# EAGLE design openEMSstim_03 (EAGLE 7.6.0)
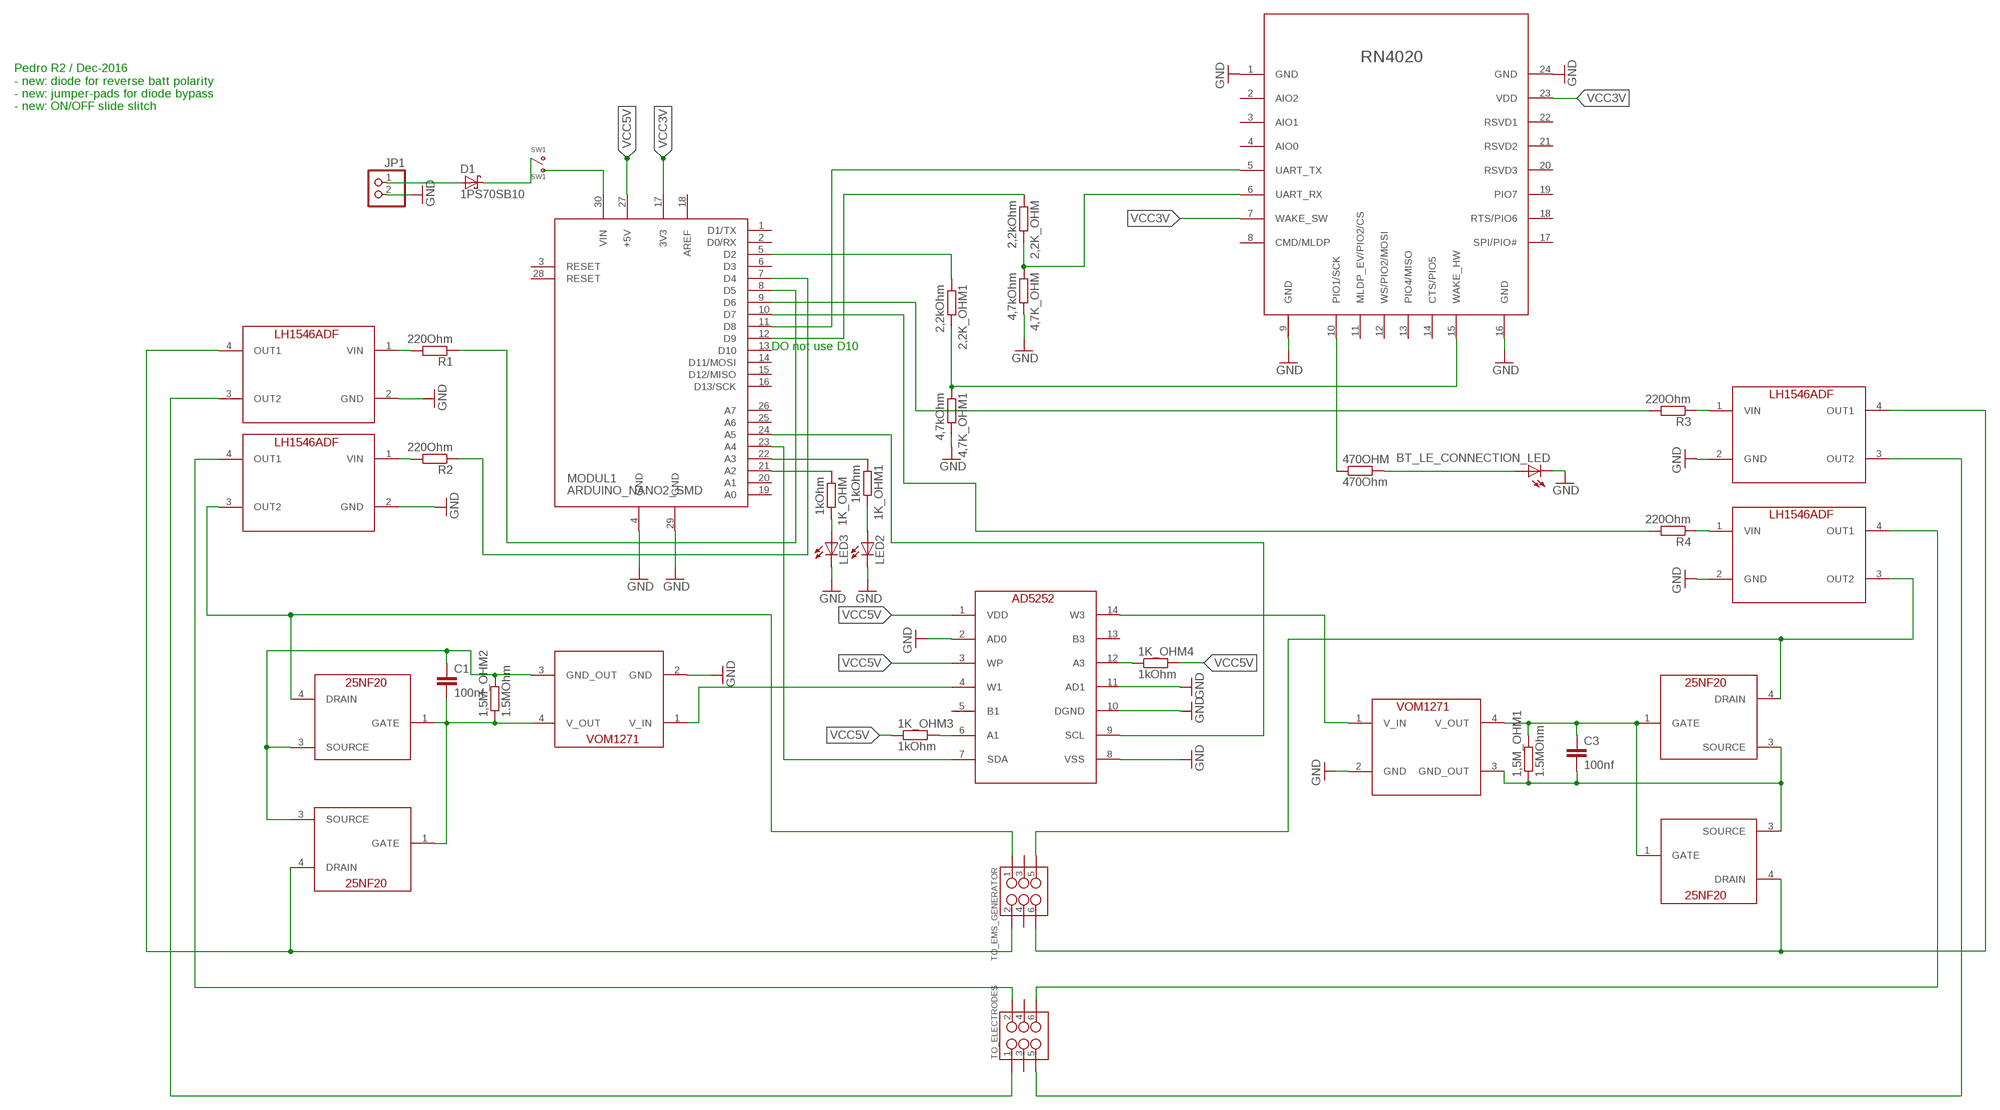
[diagram p0: schematic, sheet 1]

## Parts
1,5M_OHM1  1.5MOhm  R-EU_R0805  [R0805]
1,5M_OHM2  1.5MOhm  R-EU_R0805  [R0805]
1K_OHM  1kOhm  R-EU_R0805  [R0805]
1K_OHM1  1kOhm  R-EU_R0805  [R0805]
1K_OHM3  1kOhm  R-EU_R0805  [R0805]
1K_OHM4  1kOhm  R-EU_R0805  [R0805]
2,2K_OHM  2,2kOhm  R-EU_R0805  [R0805]
2,2K_OHM1  2,2kOhm  R-EU_R0805  [R0805]
4,7K_OHM  4,7kOhm  R-EU_R0805  [R0805]
4,7K_OHM1  4,7kOhm  R-EU_R0805  [R0805]
470OHM  470Ohm  R-EU_R0805  [R0805]
BT_LE_CONNECTION_LED  LEDCHIPLED_0603  [CHIPLED_0603]
C1  100nf  CAP0805  [0805]
C3  100nf  CAP0805  [0805]
D1  1PS70SB10  [SOT323]
JP1  PINHD-1X2  [1X02]
LED2  LEDCHIPLED_0603  [CHIPLED_0603]
LED3  LEDCHIPLED_0603  [CHIPLED_0603]
MODUL1  ARDUINO_NANO2_SMD  [ARDUINO_NANO2_SMD]
MOS01  DEV  [PACK]
MOS02  DEV  [PACK]
MOS03  DEV  [PACK]
MOS04  DEV  [PACK]
R1  220Ohm  R-EU_R0805  [R0805]
R2  220Ohm  R-EU_R0805  [R0805]
R3  220Ohm  R-EU_R0805  [R0805]
R4  220Ohm  R-EU_R0805  [R0805]
SW1  SW1  SSSS810701  [SSSS810701]
TO_ELECTRODES  M03X2  [RIGHT_ANGLED_SHROUED_2X06_6PIN]
TO_EMS_GENERATOR  M03X2  [RIGHT_ANGLED_SHROUED_2X06_6PIN]
U$5  RN4020  [RN4020]
U$6  AD5252  [TSSOP]
U$9  VOM1271  [SOP04]
U$10  VOM1271  [SOP04]
U$11  LH1546ADF  [DIP04-SMD]
U$12  LH1546ADF  [DIP04-SMD]
U$13  LH1546ADF  [DIP04-SMD]
U$14  LH1546ADF  [DIP04-SMD]

## Nets
GND: 4,7K_OHM1.2 4,7K_OHM.2 BT_LE_CONNECTION_LED.C JP1.2 LED2.C LED3.C MODUL1.4(GND) MODUL1.29(GND) U$5.1(GND) U$5.9(GND) U$5.16(GND) U$5.24(GND) U$6.2(AD0) U$6.8(VSS) U$6.10(DGND) U$6.11(AD1) U$9.2(GND) U$10.2(GND) U$11.2(GND) U$12.2(GND) U$13.2(GND) U$14.2(GND)
N$1: U$6.4(W1) U$9.1(V_IN)
N$2: 1K_OHM.1 MODUL1.21(A2)
N$3: MODUL1.23(A4) U$6.7(SDA)
N$4: TO_ELECTRODES.6 U$14.4(OUT1)
N$5: 2,2K_OHM.2 4,7K_OHM.1 U$5.6(UART_RX)
N$6: 2,2K_OHM.1 MODUL1.12(D9)
N$7: TO_ELECTRODES.1 U$11.3(OUT2)
N$8: 1,5M_OHM2.1 C1.2 MOS01.1(GATE) MOS02.1(GATE) U$9.4(V_OUT)
N$9: MODUL1.11(D8) U$5.5(UART_TX)
N$10: MODUL1.24(A5) U$6.9(SCL)
N$11: MODUL1.30(VIN) SW1.1(B)
N$12: R2.2 U$12.1(VIN)
N$13: TO_ELECTRODES.2 U$12.4(OUT1)
N$14: R1.2 U$11.1(VIN)
N$15: R3.1 U$13.1(VIN)
N$16: R4.1 U$14.1(VIN)
N$17: MODUL1.8(D5) R1.1
N$18: MODUL1.7(D4) R2.1
N$19: MODUL1.9(D6) R3.2
N$20: MODUL1.10(D7) R4.2
N$21: MOS01.4(DRAIN) TO_EMS_GENERATOR.1 U$12.3(OUT2)
N$22: U$6.14(W3) U$10.1(V_IN)
N$23: 1,5M_OHM1.2 C3.1 MOS03.1(GATE) MOS04.1(GATE) U$10.4(V_OUT)
N$24: 1,5M_OHM1.1 C3.2 MOS03.3(SOURCE) MOS04.3(SOURCE) U$10.3(GND_OUT)
N$26: 1K_OHM4.1 U$6.12(A3)
N$27: 1,5M_OHM2.2 C1.1 MOS01.3(SOURCE) MOS02.3(SOURCE) U$9.3(GND_OUT)
N$28: MOS03.4(DRAIN) TO_EMS_GENERATOR.5 U$14.3(OUT2)
N$30: MOS02.4(DRAIN) TO_EMS_GENERATOR.2 U$11.4(OUT1)
N$31: TO_ELECTRODES.5 U$13.3(OUT2)
N$32: MOS04.4(DRAIN) TO_EMS_GENERATOR.6 U$13.4(OUT1)
N$33: 2,2K_OHM1.2 4,7K_OHM1.1 U$5.15(WAKE_HW)
N$34: 1K_OHM3.2 U$6.6(A1)
N$35: 2,2K_OHM1.1 MODUL1.5(D2)
N$36: 470OHM.1 U$5.10(PIO1/SCK)
N$37: 470OHM.2 BT_LE_CONNECTION_LED.A
N$39: 1K_OHM1.2 LED2.A
N$40: 1K_OHM1.1 MODUL1.22(A3)
N$42: 1K_OHM.2 LED3.A
N$63: D1.1(A) JP1.1
N$64: D1.3(K) SW1.2(COM)
VCC3V: MODUL1.17(3V3) U$5.7(WAKE_SW) U$5.23(VDD)
VCC5V: 1K_OHM3.1 1K_OHM4.2 MODUL1.27(+5V) U$6.1(VDD) U$6.3(WP)
Unconnected: MODUL1.1(D1/TX) MODUL1.2(D0/RX) MODUL1.3(RESET) MODUL1.6(D3) MODUL1.13(D10) MODUL1.14(D11/MOSI) MODUL1.15(D12/MISO) MODUL1.16(D13/SCK) MODUL1.19(A0) MODUL1.20(A1) MODUL1.25(A6) MODUL1.26(A7) MODUL1.28(RESET) SW1.3(A) TO_ELECTRODES.3 TO_ELECTRODES.4 TO_EMS_GENERATOR.3 TO_EMS_GENERATOR.4 U$5.2(AIO2) U$5.3(AIO1) U$5.4(AIO0) U$5.8(CMD/MLDP) U$5.11(MLDP_EV/PIO2/CS) U$5.12(WS/PIO2/MOSI) U$5.13(PIO4/MISO) U$5.14(CTS/PIO5) U$5.17(SPI/PIO#) U$5.18(RTS/PIO6) U$5.19(PIO7) U$5.20(RSVD3) U$5.21(RSVD2) U$5.22(RSVD1) U$6.5(B1) U$6.13(B3)

## Notes on the sheet
- Pedro R2 / Dec-2016
  - new: diode for reverse batt polarity
  - new: jumper-pads for diode bypass
  - new: ON/OFF slide slitch
- DO not use D10

## Power pins joined to a net without a drawn wire
AREF: MODUL1.18(AREF)

## Library data of the parts
1,5M_OHM1 1,5M_OHM2 1K_OHM 1K_OHM1 1K_OHM3 1K_OHM4 2,2K_OHM 2,2K_OHM1 4,7K_OHM 4,7K_OHM1 470OHM R1-R4 = resistor:R-EU_: RESISTOR, European symbol
BT_LE_CONNECTION_LED LED2 LED3 = adafruit:LED: LED OSRAM: - CHIPLED LG R971, LG N971, LY N971, LG Q971, LY Q971, LO R971, LY R971 LH N974, LH R974 LS Q976, LO Q976, LY Q976 LO Q996 - Hyper CHIPLED LW Q18S LB Q993, LB Q99A, LB R99A - SideLED LS A670, LO A670, LY A670, LG A670, LP A670 LB A673, LV A673, LT A673, LW A673 LH A674 LY A675 LS A676, LA A676, LO A676, LY A676, LW A676 LS A679, LY A679, LG A679 - Hyper Micro SIDELED® LS Y876, LA Y876, LO Y876, LY Y876 LT Y87S - SmartLED LW L88C, LW L88S LB L89C, LB L89S, LG L890 LS L89K, LO L89K, LY L89K LS L896, LA L896, LO L896, LY L896 - TOPLED LS T670, LO T670, LY T670, LG T670, LP T670 LSG T670, LSP T670, LSY T670, LOP T670, LYG T670 LG T671, LOG T671, LSG T671 LB T673, LV T673, LT T673, LW T673 LH T674 LS T676, LA T676, LO T676, LY T676, LB T676, LH T676, LSB T676, LW T676 LB T67C, LV T67C, LT T67C, LS T67K, LO T67K, LY T67K, LW E67C LS E67B, LA E67B, LO E67B, LY E67B, LB E67C, LV E67C, LT E67C LW T67C LS T679, LY T679, LG T679 LS T770, LO T770, LY T770, LG T770, LP T770 LB T773, LV T773, LT T773, LW T773 LH T774 LS E675, LA E675, LY E675, LS T675 LS T776, LA T776, LO T776, LY T776, LB T776 LHGB T686 LT T68C, LB T68C - Hyper Mini TOPLED® LB M676 - Mini TOPLED Santana® LG M470 LS M47K, LO M47K, LY M47K Source: http://www.osram.convergy.de/
C1 C3 = SparkFun-Passives:CAP: Capacitor Standard 0603 ceramic capacitor, and 0.1" leaded capacitor.
D1 = nxp_60:1PS70SB10: Schottky barrier diode Planar Schottky barrier diode encapsulated in a SOT323 very small plastic SMD package. Single diodes and double diodes with different pinning are available. AAL Eindhoven MK
JP1 = pinhead:PINHD-1X2: PIN HEADER
MODUL1 = arduino:ARDUINO_NANO2_SMD
MOS01-MOS04 = Tim:DEV
SW1 = alps:SSSS810701
TO_ELECTRODES TO_EMS_GENERATOR = Tim:M03X2: 2x3 .1" header. Shrouded, with keying- CONN-10681 SMT- CONN-11415 Pogo pins- HW-11044
U$5 = microchip:RN4020
U$6 = Tim:AD5252
U$9 U$10 = Tim:VOM1271
U$11-U$14 = Tim:LH1546ADF

## Board
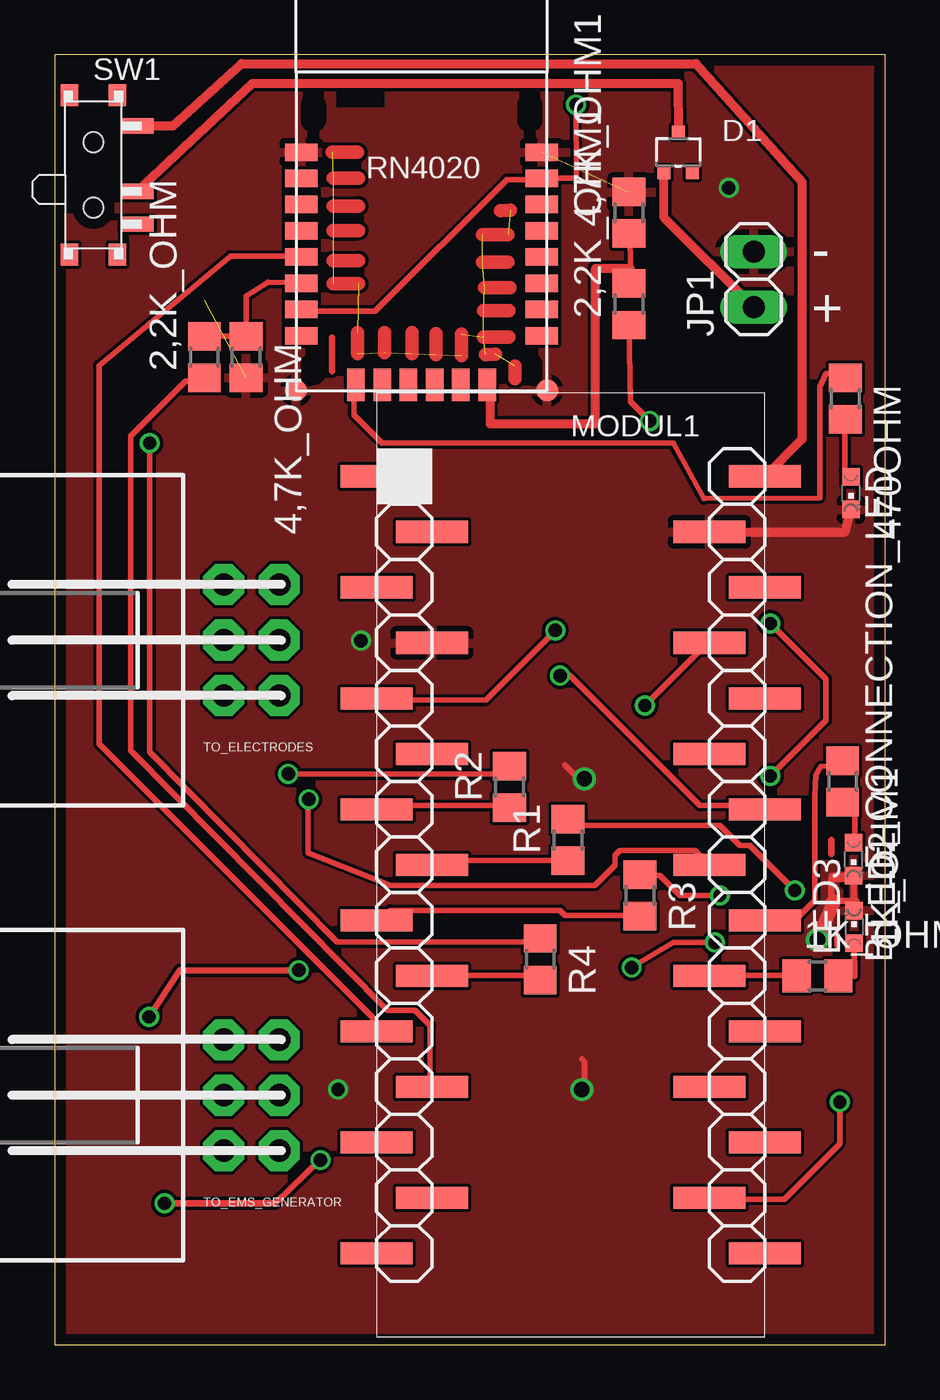
[diagram p1: board, top side]
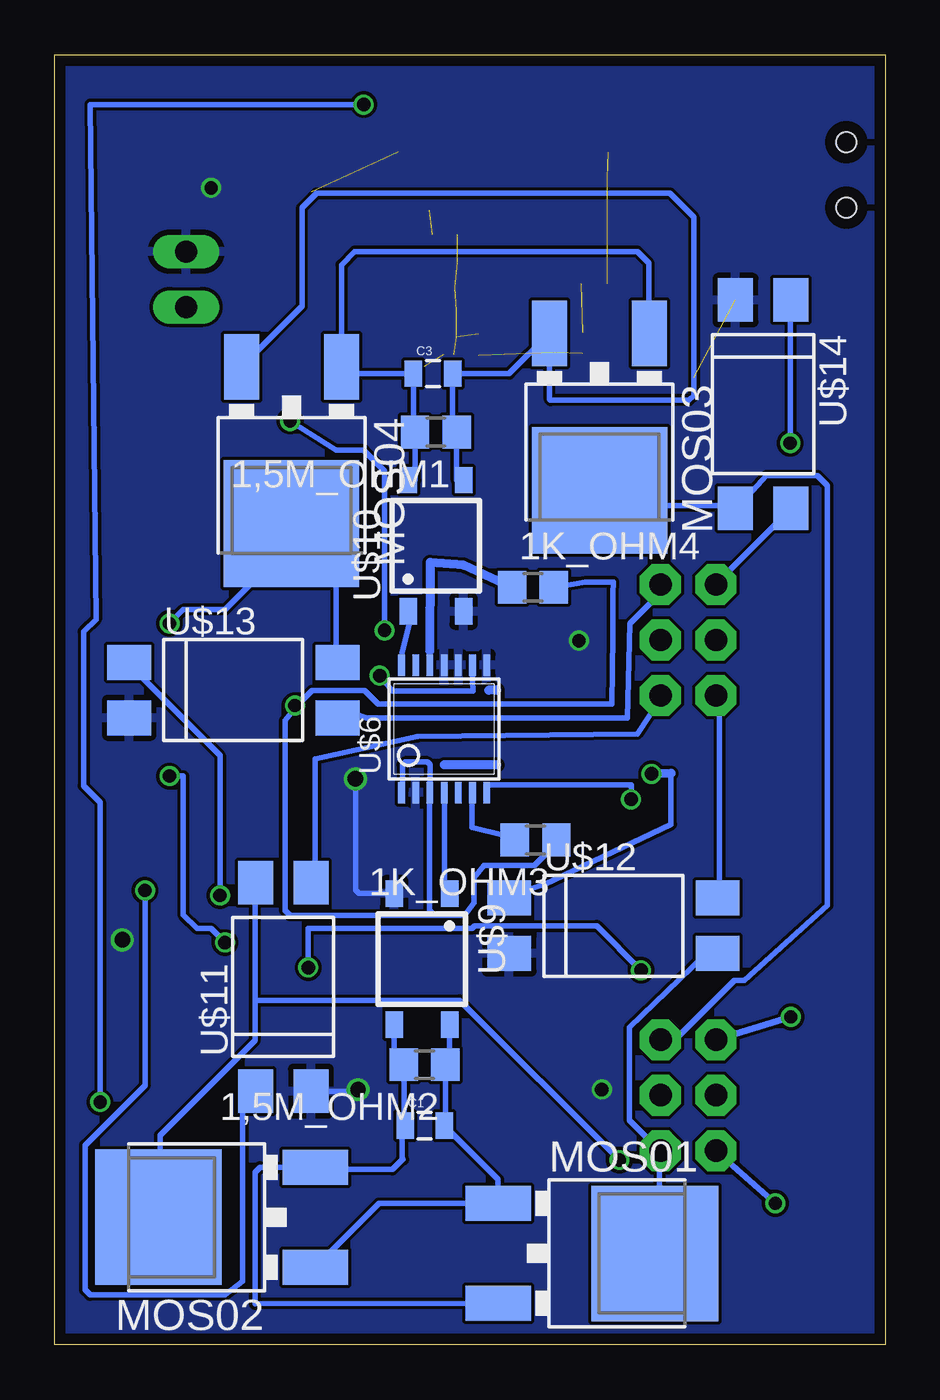
[diagram p2: board, bottom side, seen from below]

Size 38.02 x 59.05 mm. Coordinates in mm from the lower left corner, seen from the top.
Outline: 0,0 38.02,0 38.02,59.05 0,59.05 0,0
Copper layers (1*16): Top 0.035mm / dielectric 1.6mm / Bottom 0.035mm
Design rules "Elecrow_2-layer_PCB_eagle_rule": minimum track width 6mil, minimum drill 12mil, track to track 6mil, track to pad 6mil, pad to pad 6mil, via to via 8mil, smd to smd 0mil, copper to edge 20mil, drill to drill 10mil, minimum pad ring 6mil, minimum via ring 6mil, stop-mask expansion 0mil, vias tented up to drill 100mil, thermal gap 10mil

### Footprints (pad centres in the part's own frame; a part is rotated, then mirrored left to right if it is on the bottom)
R0805 = smd 1.3 x 1.5: 1 -0.95,0; 2 0.95,0
CHIPLED_0603 = smd 0.8 x 0.8: A 0,-0.75; C 0,0.75
0805 = smd 0.8 x 1.2: 1 -0.9,0; 2 0.9,0
SOT323 = smd 0.6 x 0.6: 1 -0.65,-0.925; 2 0.65,-0.925; 3 0,0.925
1X02 = drill 1.016 long: 1 -1.27,0; 2 1.27,0
ARDUINO_NANO2_SMD = smd 3.302 x 1.016: 1 -17.78,-3.81; 2 -15.24,-6.35; 3 -17.78,-8.89; 4 -15.24,-11.43; 5 -17.78,-13.97; 6 -15.24,-16.51; 7 -17.78,-19.05; 8 -15.24,-21.59; 9 -17.78,-24.13; 10 -15.24,-26.67; 11 -17.78,-29.21; 12 -15.24,-31.75; 13 -17.78,-34.29; 14 -15.24,-36.83; 15 -17.78,-39.37; 16 0,-39.37; 17 -2.54,-36.83; 18 0,-34.29; 19 -2.54,-31.75; 20 0,-29.21; 21 -2.54,-26.67; 22 0,-24.13; 23 -2.54,-21.59; 24 0,-19.05; 25 -2.54,-16.51; 26 0,-13.97; 27 -2.54,-11.43; 28 0,-8.89; 29 -2.54,-6.35; 30 0,-3.81
PACK = smd 1.6 x 3: 1 -6.096,-2.1; 3 -1.524,-2.1 | smd 6.2 x 5.8: 4 -3.81,5.08
SSSS810701 = smd 0.7 x 1.5: 1 -2.25,2; 2 0.75,2; 3 2.25,2 | smd 1 x 0.8: 4.1 -3.65,1.1; 4.2 3.65,1.1; 4.3 -3.65,-1.1; 4.4 3.65,-1.1 | hole 0.9: 1.5,0; -1.5,0
RIGHT_ANGLED_SHROUED_2X06_6PIN = drill 1.016 pad 1.88 octagon: 1 13.46,5.46; 2 10.92,5.46; 3 13.46,8; 4 10.92,8; 5 13.46,10.54; 6 10.92,10.54
RN4020 = smd 1.5 x 0.8: 1 0.25,10.9; 2 0.25,9.7; 3 0.25,8.5; 4 0.25,7.3; 5 0.25,6.1; 6 0.25,4.9; 7 0.25,3.7; 8 0.25,2.5; 17 11.25,2.5; 18 11.25,3.7; 19 11.25,4.9; 20 11.25,6.1; 21 11.25,7.3; 22 11.25,8.5; 23 11.25,9.7; 24 11.25,10.9 | smd 1 x 1: 9 0,0; 16 11.5,0 | smd 0.8 x 1.5: 10 2.75,0.25; 11 3.95,0.25; 12 5.15,0.25; 13 6.35,0.25; 14 7.55,0.25; 15 8.75,0.25
TSSOP = smd 0.305 x 0.991: 1 -1.95,-2.918; 2 -1.3,-2.918; 3 -0.65,-2.918; 4 0,-2.918; 5 0.65,-2.918; 6 1.3,-2.918; 7 1.95,-2.918; 8 1.95,2.918; 9 1.3,2.918; 10 0.65,2.918; 11 0,2.918; 12 -0.65,2.918; 13 -1.3,2.918; 14 -1.95,2.918
SOP04 = smd 0.8 x 1.2: 1 -1.27,-3; 2 1.27,-3; 3 1.27,3; 4 -1.27,3
DIP04-SMD = smd 1.6 x 2: 1 -1.27,-4.77; 2 1.27,-4.77; 3 1.27,4.77; 4 -1.27,4.77

### Placement (x,y rotation side)
1,5M_OHM1  20.57,41.78 180 bottom
1,5M_OHM2  21.08,12.83 180 bottom
1K_OHM  34.92,16.89 0 top
1K_OHM1  36.07,25.78 270 top
1K_OHM3  16,23.11 180 bottom
1K_OHM4  16.13,34.67 0 bottom
2,2K_OHM  6.86,45.21 90 top
2,2K_OHM1  26.29,47.62 90 top
4,7K_OHM  8.76,45.21 270 top
4,7K_OHM1  26.29,51.82 90 top
470OHM  36.2,43.31 270 top
BT_LE_CONNECTION_LED  36.45,38.99 180 top
C1  21.08,10.03 0 bottom
C3  20.7,44.45 0 bottom
D1  28.55,54.58 0 top
JP1  32,48.77 90 top
LED2  36.58,22.23 180 top
LED3  36.6,19.13 0 top
MODUL1  32.51,43.56 0 top
MOS01  15.62,0.38 270 bottom
MOS02  28.19,9.65 90 bottom
MOS03  16.89,44.2 180 bottom
MOS04  30.99,42.67 180 bottom
R1  23.5,23.11 90 top
R2  20.83,25.53 90 top
R3  26.8,20.57 270 top
R4  22.23,17.65 270 top
SW1  1.78,53.54 270 top
TO_ELECTRODES  -3.17,24.26 0 top
TO_EMS_GENERATOR  -3.17,3.43 0 top
U$5  11.05,43.69 0 top
U$6  20.19,28.19 0 bottom
U$9  21.21,17.65 180 bottom
U$10  20.57,36.58 0 bottom
U$11  27.56,16.38 0 bottom
U$12  12.45,19.18 270 bottom
U$13  29.84,29.97 270 bottom
U$14  5.59,43.05 180 bottom

### Tracks (layer width: path | path; a pad name or v marks a point on that pad's centre or on a via)
GND  (via drill 0.61, 0.61 pad 0.61, 0.7)  (2 unrouted)
  Top 0.254: 14.22,32.13 14.1,32.26 v14.02,32.23 13.72,32.13 | v24.13,11.68 24.13,11.81 24.26,11.94 24.26,12.95 24.13,13.08 | v24.26,25.91 24,25.91 23.37,26.54 | 36.63,21.49 LED2.C 36.63,21.49 | 36.63,21.49 35.59,21.49 35.56,21.46 35.56,21.34
  Top 0.305: 35.43,20.32 35.69,20.32 36.58,20.32 | 36.7,20.32 36.58,20.32 | 36.58,20.32 36.58,21.34 35.56,21.34 35.56,20.19
  Top 0.406: MODUL1.29 36.2,37.21 BT_LE_CONNECTION_LED.C | 13.84,32.36 13.84,32.18 14.02,32.18 v14.02,32.23
  Top 0.61: 35.69,20.32 v34.92,18.54
  Bottom 0.254: U$11.2 24.2,11.61 v24.13,11.68 | U$9.2 24.08,20.65 24.26,20.83 v24.26,25.91 | U$13.2 34.57,28.8 34.57,28.9
  other vias: 30.86,52.96 12.98,11.68
  pour Bottom: -5.97,64.77 -5.97,-1.27 41.66,-1.27 41.66,65.41 -5.97,65.41
  pour Top: -6.6,66.04 42.29,66.04 42.29,-1.91 -6.6,-1.91
N$1
  Bottom 0.254: U$6.4 20.17,25.15 20.17,21.03 19.94,20.8 U$9.1
N$2
  Top 0.254: 1K_OHM.1 33.88,16.92 30,16.92 MODUL1.21
N$3  (via drill 0.61)
  Top 0.254: v11.63,24.97 11.81,24.97 11.61,24.89 11.61,22.5 15.37,21.03 24.74,21.03 25.65,21.95 25.65,22.4 25.88,22.63 29.31,22.63 MODUL1.23
  Bottom 0.254: v11.63,24.97 11.61,25.63 18.24,25.63 U$6.7
N$4
  Bottom 0.254: U$14.4 4.39,38.18 7.6,34.98 TO_ELECTRODES.6
N$5
  Top 0.254: U$5.6 9.78,48.64 8.76,48.01 4,7K_OHM.1 2,2K_OHM.2
N$6
  Top 0.254: 2,2K_OHM.1 6.68,44.12 5.99,44.12 3.48,41.6 3.48,27.2 15.24,15.32 16.51,15.32 17.2,14.63 17.2,11.89 MODUL1.12
N$7
  Bottom 0.254: U$11.3 26.11,21.26 26.11,26.82 21.41,27.84 11.35,27.96 10.34,29.49 TO_ELECTRODES.1
N$8
  Bottom 0.254: U$9.4 19.94,13.02 1,5M_OHM2.1 20.13,10.08 C1.2 17.72,7.57 MOS01.1 23.17,6.48 MOS02.1
N$9
  Top 0.254: U$5.5 11.25,49.84 8.05,49.84 2.03,44.83 2.03,27.51 14.68,14.86 14.68,14.4 MODUL1.11
N$10  (via drill 0.61)
  Top 0.254: v23.14,30.63 23.6,30.63 29.54,24.69 32.51,24.69 MODUL1.24
  Bottom 0.254: v23.14,30.63 22.55,29.92 18.87,29.92 18.9,30.4 18.9,31.09 U$6.9
N$11
  Top 0.406: SW1.1 5.43,55.79 8.56,58.65 29.36,58.65 34.21,53.24 34.21,41.45 MODUL1.30
N$12  (via drill 0.61)
  Top 0.254: v10.69,26.14 21.44,26.14 R2.2
  Bottom 0.254: 9.8,26.16 9.8,23.82 15.6,21.08 17.2,20.57 U$12.1
  Bottom 0.406: 9.8,26.16 v10.69,26.14
N$13
  Bottom 0.254: U$12.4 7.6,20.57 7.6,29.49 TO_ELECTRODES.2
N$14  (via drill 0.61)
  Top 0.254: v33.88,20.8 31.83,22.86 31.37,22.86 30.45,23.77 24.05,23.77 R1.2
  Bottom 0.254: v33.88,20.8 33.88,11.89 36.63,9.14 36.63,2.52 36.4,2.29 30.23,2.29 29.41,2.92 29.41,10.69 U$11.1
N$15  (via drill 0.61)
  Top 0.254: v30.45,20.57 28.63,20.57 27.71,21.49 26.8,21.49 R3.1
  Bottom 0.254: v30.45,20.57 30.45,26.98 34.57,31.09 U$13.1
N$16  (via drill 0.61)
  Top 0.254: v4.35,41.27 4.35,27.15 12.92,18.45 22.13,18.45 R4.1
  Bottom 0.254: v4.35,41.27 4.35,47.78 U$14.1
N$17
  Top 0.254: R1.1 23.82,22.17 17.42,22.17 MODUL1.8
N$18
  Top 0.254: R2.1 21.31,24.69 14.91,24.69 MODUL1.7
N$19
  Top 0.254: R3.2 26.8,19.66 23.37,19.66 23.14,19.89 15.37,19.89 14.91,19.43 MODUL1.9
N$20
  Top 0.254: R4.2 22.23,16.92 17.42,16.92 MODUL1.10
N$21
  Bottom 0.254: 7.84,17.83 8.28,17.83 11.71,14.53 11.71,10.29 10.34,8.91 TO_EMS_GENERATOR.1 10.34,8.69 10.34,4.34 MOS01.4 | 7.84,17.83 7.82,17.83 | U$12.3 7.68,17.94 7.84,17.94 7.84,17.83
N$22
  Bottom 0.254: U$6.14 22.12,31.7 21.74,33.12 U$10.1
N$23
  Bottom 0.254: U$10.4 21.52,39.58 1,5M_OHM1.2 21.6,41.86 C3.1 24.57,44.45 MOS04.1 24.89,49.43 24.28,50.04 11.35,50.04 10.82,49.51 10.82,46.32 MOS03.1
N$24
  Bottom 0.254: U$10.3 19.62,39.58 1,5M_OHM1.1 19.8,41.78 C3.2 17.21,44.45 MOS03.3 15.37,43.28 15.32,43.23 8.99,43.23 8.76,43.46 8.76,51.61 9.86,52.7 26.04,52.7 26.7,52.05 26.7,47.54 MOS04.3
N$26
  Bottom 0.254: 20.85,31.77 20.85,31.32 U$6.12
  Bottom 0.406: 1K_OHM4.1 19.3,35.69 20.83,35.81 20.85,31.77
N$27
  Bottom 0.254: 17.72,1.8 MOS01.3 | 17.72,1.4 MOS01.3 | U$9.3 22.48,13.27 1,5M_OHM2.2 22.03,10.08 C1.1 22.12,9.89 22.12,8.53 22.07,8.48 22.1,8.48 22.55,8.03 25.99,8.03 MOS02.3 28.63,8.13 28.85,7.9 28.85,1.88 MOS01.3
N$28
  Bottom 0.254: MOS03.4 13.08,39.09 12.39,38.41 6.91,38.41 U$14.3 6.68,38.41 5.44,39.78 3.1,39.78 2.64,39.32 2.64,20.12 6.45,16.69 6.91,16.69 9.42,14.17 10.11,14.17 TO_EMS_GENERATOR.5
N$30  (via drill 0.61)
  Top 0.254: v12.17,8.46 12.14,8.46
  Top 0.305: 12.14,8.46 10.08,6.48 v5.03,6.48
  Bottom 0.254: 28.85,15.77 28.85,13.95 33.2,9.6 33.2,5.94 MOS02.4 | 28.85,15.77 28.85,21.03 U$11.4 | v12.17,8.46 19.48,15.77 28.85,15.77
  Bottom 0.305: v5.03,6.48 TO_EMS_GENERATOR.2
N$31
  Bottom 0.254: U$13.3 24.97,28.8 24.79,29.06 23.75,28.7 11.81,28.7 11.68,33.02 10.34,34.37 10.34,34.75 TO_ELECTRODES.5
N$32  (via drill 0.61)
  Top 0.254: v26.42,17.27 28.32,18.41 v30.23,18.41 | v32.77,26.04 35.31,28.57 35.31,30.48 v32.77,33.02 | 8,13.97 TO_EMS_GENERATOR.6
  Top 0.305: v11.18,17.14 5.71,17.14 v4.32,15.01
  Bottom 0.254: 26.42,37.47 27.05,37.47 MOS04.4 26.42,37.47 | 26.42,37.47 25.15,37.47 25.15,31.75 U$13.4 | v11.18,17.14 13.21,19.18 18.8,19.18 18.92,19.05 26.42,19.05 v26.42,17.27 | v30.23,18.41 30.86,19.05 31.5,19.05 32.13,19.68 32.13,26.04 v32.77,26.04 | v32.77,33.02 32.13,33.66 30.23,33.66 26.42,37.47
  Bottom 0.305: v4.32,15.01 TO_EMS_GENERATOR.6
N$33
  Top 0.254: 2,2K_OHM1.2 26.35,48.67 26.35,49.28 26.35,49.94 4,7K_OHM1.1
  Top 0.406: U$5.15 19.94,43.94 19.94,42.16 24.77,42.16 24.77,49.28 26.35,49.28
N$34
  Bottom 0.254: U$6.6 18.92,25.02 18.92,23.67 17.42,23.32 16.97,23.32 1K_OHM3.2
N$35  (via drill 0.61)
  Top 0.254: v27.24,42.29 26.35,43.18 2,2K_OHM1.1 | v22.92,32.7 19.75,29.53 14.99,29.53 MODUL1.5
  Bottom 0.254: v27.24,42.29 25.15,40.96 23.88,40.96 22.92,40.01 v22.92,32.7
N$36
  Top 0.254: U$5.10 13.72,43.81 13.72,42.55 14.99,41.27 28.32,41.27 29.72,38.73 35.03,38.76 35.03,43.84 35.31,44.45 35.94,44.45 470OHM.1
N$37
  Top 0.254: 470OHM.2 36.17,42.29 36.17,40.02 BT_LE_CONNECTION_LED.A
N$39
  Top 0.254: LED2.A 36.63,23.09 36.63,24.69 1K_OHM1.2
N$40
  Top 0.254: MODUL1.22 33.88,19.43 34.8,20.34 34.8,25.15 34.85,26.09 35.08,26.47 36.4,26.52 1K_OHM1.1
N$42
  Top 0.254: LED3.A 36.63,16.87 36.35,16.94 35.94,16.92 1K_OHM.2
N$47
  Top 0.305: 35.56,23.11 35.56,22.48
N$49
  Top 0.254: 35.81,18.8 35.81,18.29
N$50
  Bottom 0.406: 17.78,29.97 18.16,29.97
N$51
  Bottom 0.406: 17.78,26.54 20.19,26.54
N$53
  Top 0.305: 12.7,46.1 12.7,44.58
N$63
  Top 0.406: JP1.1 27.9,51.6 D1.1
N$64
  Top 0.406: D1.3 28.58,55.53 28.55,57.73 9.05,57.73 SW1.2
PUFFER_1  (18 unrouted)
  Top 0.61: 12.7,54.59 13.87,54.59 | 12.75,53.39 13.92,53.39 | 12.75,52.12 13.92,52.12 | 12.75,51 13.92,51 | 12.75,49.63 13.92,49.63 | 12.75,48.56 13.92,48.56 | 19.63,46.13 20.8,46.13 | 19.58,50.83 20.75,50.83 | 19.58,49.55 20.75,49.55 | 19.68,48.39 20.85,48.39 | 19.63,47.35 20.8,47.35 | 13.87,45.36 13.87,46.33 | 15.11,45.41 15.11,46.33 | 16.36,45.36 16.36,46.33 | 17.45,45.31 17.45,46.28 | 18.62,45.29 18.62,46.25 | 20.42,51.92 20.88,51.94 | 19.74,45.31 20.19,45.34 | 21.08,44.81 21.08,44.22
VCC3V  (via drill 0.61)
  Top 0.254: U$5.7 11.49,47.31 14.67,47.31 20.7,53.34 22.29,53.34 U$5.23 23.88,53.39 v23.88,56.77 | v35.94,11.11 35.94,9.21 33.4,6.67 30.23,6.67 MODUL1.17
  Bottom 0.254: v35.94,11.11 35.94,24.83 36.7,25.59 36.7,32.64 36.13,33.21 36.39,56.77 v23.88,56.77
VCC5V  (via drill 0.61)
  Top 0.254: v27.03,29.26 29.77,32 MODUL1.27
  Bottom 0.254: 20.62,19.66 20.85,19.89 20.85,25.27 U$6.3 20.84,26.56 20.95,26.67 21.97,26.67 22.1,26.54 22.1,25.32 U$6.1 | 20.62,19.66 19.25,19.66 18.82,20.22 18.82,21.36 18.36,21.95 16.05,21.95 14.91,23.09 1K_OHM3.1 | 26.92,29.26 27.48,28.57 27.48,19.89 27.25,19.66 20.62,19.66 | 26.92,29.26 26.24,29.95 23.82,29.95 23.22,29.34 12.52,29.34 12.47,32.44 12.47,34.39 12.45,34.92 13.72,34.92 1K_OHM4.2 | 26.92,29.26 v27.03,29.26

### Text on the board
tPlace: - / +
Name: openEMSstim v2 / plopes.org/ems | open / EMS / stim
_bNames: V002 EMS WS Module | HCI - Hannover